# EAGLE design switches (EAGLE 9.6.2)
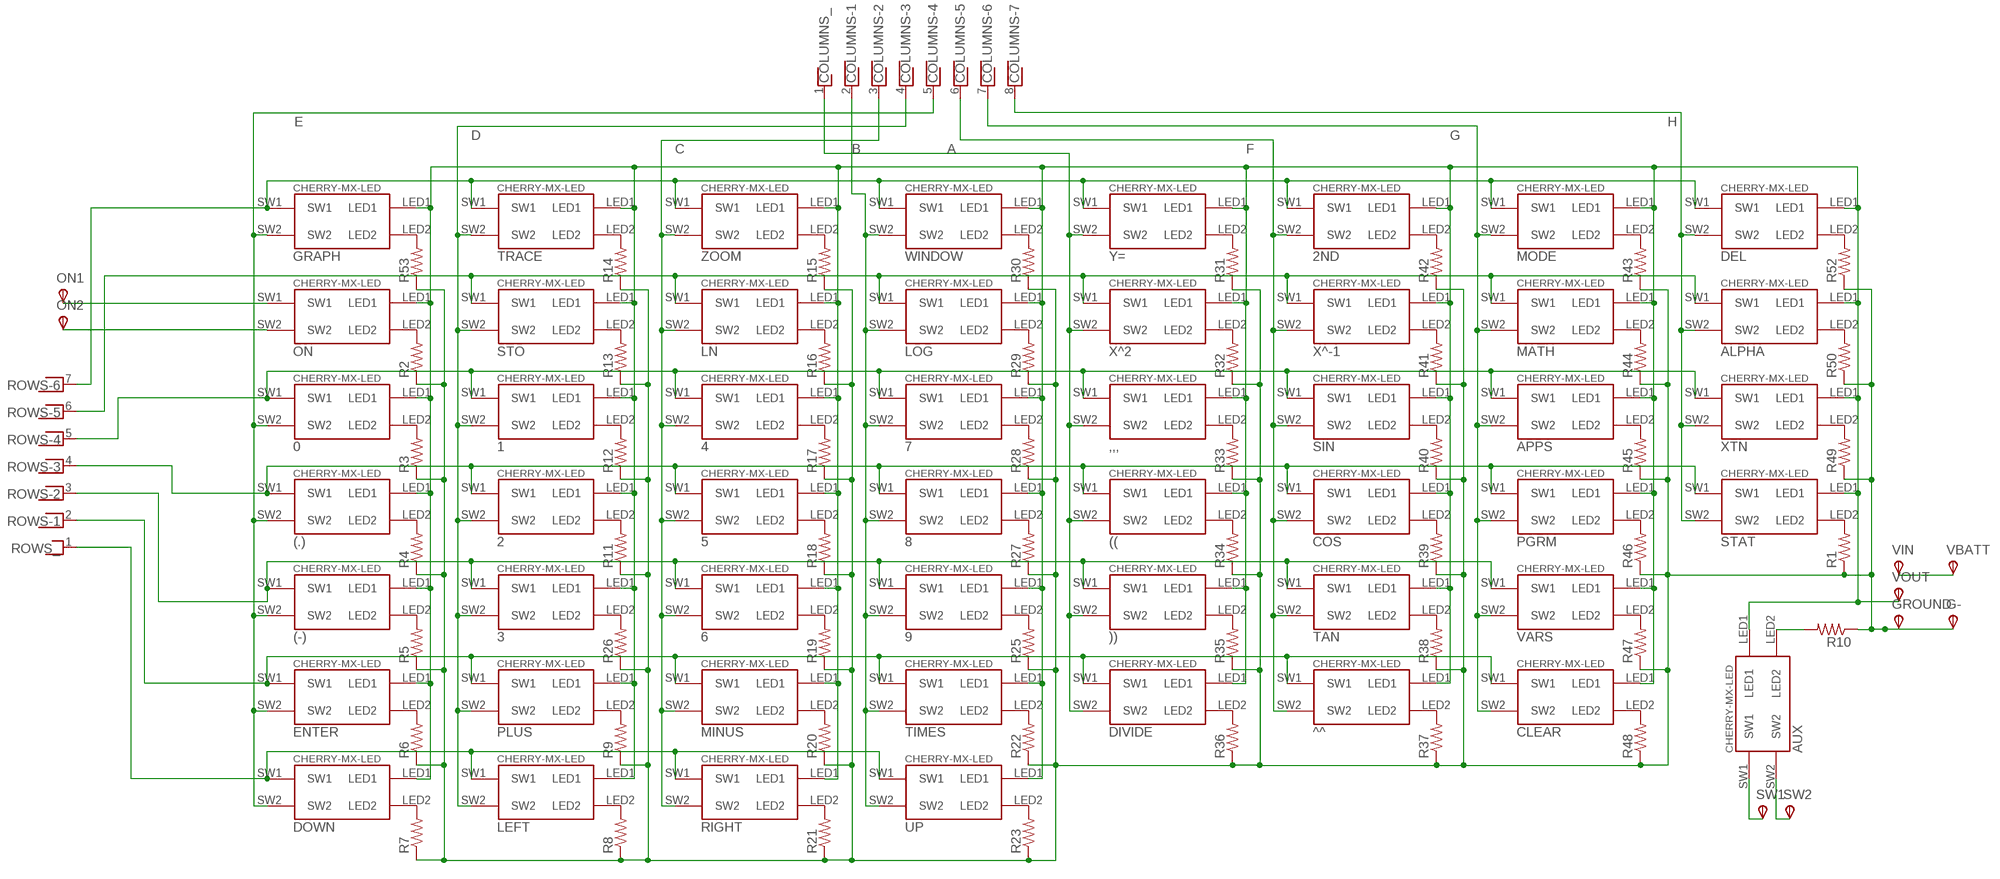
[diagram p0: schematic, sheet 1]

## Parts
0  CHERRY-MX-LEDNOSILK  [CHERRY-MX-LED-NOSILK]
1  CHERRY-MX-LEDNOSILK  [CHERRY-MX-LED-NOSILK]
2  CHERRY-MX-LEDNOSILK  [CHERRY-MX-LED-NOSILK]
2ND  CHERRY-MX-LEDNOSILK  [CHERRY-MX-LED-NOSILK]
3  CHERRY-MX-LEDNOSILK  [CHERRY-MX-LED-NOSILK]
4  CHERRY-MX-LEDNOSILK  [CHERRY-MX-LED-NOSILK]
5  CHERRY-MX-LEDNOSILK  [CHERRY-MX-LED-NOSILK]
6  CHERRY-MX-LEDNOSILK  [CHERRY-MX-LED-NOSILK]
7  CHERRY-MX-LEDNOSILK  [CHERRY-MX-LED-NOSILK]
8  CHERRY-MX-LEDNOSILK  [CHERRY-MX-LED-NOSILK]
9  CHERRY-MX-LEDNOSILK  [CHERRY-MX-LED-NOSILK]
((  CHERRY-MX-LEDNOSILK  [CHERRY-MX-LED-NOSILK]
(-)  CHERRY-MX-LEDNOSILK  [CHERRY-MX-LED-NOSILK]
(.)  CHERRY-MX-LEDNOSILK  [CHERRY-MX-LED-NOSILK]
))  CHERRY-MX-LEDNOSILK  [CHERRY-MX-LED-NOSILK]
,,,  CHERRY-MX-LEDNOSILK  [CHERRY-MX-LED-NOSILK]
^^  CHERRY-MX-LEDNOSILK  [CHERRY-MX-LED-NOSILK]
ALPHA  CHERRY-MX-LEDNOSILK  [CHERRY-MX-LED-NOSILK]
APPS  CHERRY-MX-LEDNOSILK  [CHERRY-MX-LED-NOSILK]
AUX  CHERRY-MX-LEDNOSILK  [CHERRY-MX-LED-NOSILK]
CLEAR  CHERRY-MX-LEDNOSILK  [CHERRY-MX-LED-NOSILK]
COLUMNS  RNX7  [RN-8]
COS  CHERRY-MX-LEDNOSILK  [CHERRY-MX-LED-NOSILK]
DEL  CHERRY-MX-LEDNOSILK  [CHERRY-MX-LED-NOSILK]
DIVIDE  CHERRY-MX-LEDNOSILK  [CHERRY-MX-LED-NOSILK]
DOWN  CHERRY-MX-LEDNOSILK  [CHERRY-MX-LED-NOSILK]
ENTER  CHERRY-MX-LEDNOSILK  [CHERRY-MX-LED-NOSILK]
G-  TPSPAD1-17  [P1-17]
GRAPH  CHERRY-MX-LEDNOSILK  [CHERRY-MX-LED-NOSILK]
GROUND  TPSPAD1-17  [P1-17]
LEFT  CHERRY-MX-LEDNOSILK  [CHERRY-MX-LED-NOSILK]
LN  CHERRY-MX-LEDNOSILK  [CHERRY-MX-LED-NOSILK]
LOG  CHERRY-MX-LEDNOSILK  [CHERRY-MX-LED-NOSILK]
MATH  CHERRY-MX-LEDNOSILK  [CHERRY-MX-LED-NOSILK]
MINUS  CHERRY-MX-LEDNOSILK  [CHERRY-MX-LED-NOSILK]
MODE  CHERRY-MX-LEDNOSILK  [CHERRY-MX-LED-NOSILK]
ON  CHERRY-MX-LEDNOSILK  [CHERRY-MX-LED-NOSILK]
ON1  TPSPAD1-17  [P1-17]
ON2  TPSPAD1-17  [P1-17]
PGRM  CHERRY-MX-LEDNOSILK  [CHERRY-MX-LED-NOSILK]
PLUS  CHERRY-MX-LEDNOSILK  [CHERRY-MX-LED-NOSILK]
R1  R-US_R0805  [R0805]
R2  R-US_R0805  [R0805]
R3  R-US_R0805  [R0805]
R4  R-US_R0805  [R0805]
R5  R-US_R0805  [R0805]
R6  R-US_R0805  [R0805]
R7  R-US_R0805  [R0805]
R8  R-US_R0805  [R0805]
R9  R-US_R0805  [R0805]
R10  R-US_R0805  [R0805]
R11  R-US_R0805  [R0805]
R12  R-US_R0805  [R0805]
R13  R-US_R0805  [R0805]
R14  R-US_R0805  [R0805]
R15  R-US_R0805  [R0805]
R16  R-US_R0805  [R0805]
R17  R-US_R0805  [R0805]
R18  R-US_R0805  [R0805]
R19  R-US_R0805  [R0805]
R20  R-US_R0805  [R0805]
R21  R-US_R0805  [R0805]
R22  R-US_R0805  [R0805]
R23  R-US_R0805  [R0805]
R25  R-US_R0805  [R0805]
R26  R-US_R0805  [R0805]
R27  R-US_R0805  [R0805]
R28  R-US_R0805  [R0805]
R29  R-US_R0805  [R0805]
R30  R-US_R0805  [R0805]
R31  R-US_R0805  [R0805]
R32  R-US_R0805  [R0805]
R33  R-US_R0805  [R0805]
R34  R-US_R0805  [R0805]
R35  R-US_R0805  [R0805]
R36  R-US_R0805  [R0805]
R37  R-US_R0805  [R0805]
R38  R-US_R0805  [R0805]
R39  R-US_R0805  [R0805]
R40  R-US_R0805  [R0805]
R41  R-US_R0805  [R0805]
R42  R-US_R0805  [R0805]
R43  R-US_R0805  [R0805]
R44  R-US_R0805  [R0805]
R45  R-US_R0805  [R0805]
R46  R-US_R0805  [R0805]
R47  R-US_R0805  [R0805]
R48  R-US_R0805  [R0805]
R49  R-US_R0805  [R0805]
R50  R-US_R0805  [R0805]
R52  R-US_R0805  [R0805]
R53  R-US_R0805  [R0805]
RIGHT  CHERRY-MX-LEDNOSILK  [CHERRY-MX-LED-NOSILK]
ROWS  RNX6  [RN-7]
SIN  CHERRY-MX-LEDNOSILK  [CHERRY-MX-LED-NOSILK]
STAT  CHERRY-MX-LEDNOSILK  [CHERRY-MX-LED-NOSILK]
STO  CHERRY-MX-LEDNOSILK  [CHERRY-MX-LED-NOSILK]
SW1  TPSPAD1-17  [P1-17]
SW2  TPSPAD1-17  [P1-17]
TAN  CHERRY-MX-LEDNOSILK  [CHERRY-MX-LED-NOSILK]
TIMES  CHERRY-MX-LEDNOSILK  [CHERRY-MX-LED-NOSILK]
TRACE  CHERRY-MX-LEDNOSILK  [CHERRY-MX-LED-NOSILK]
UP  CHERRY-MX-LEDNOSILK  [CHERRY-MX-LED-NOSILK]
VARS  CHERRY-MX-LEDNOSILK  [CHERRY-MX-LED-NOSILK]
VBATT  TPSPAD1-17  [P1-17]
VIN  TPSPAD1-17  [P1-17]
VOUT  TPSPAD1-17  [P1-17]
WINDOW  CHERRY-MX-LEDNOSILK  [CHERRY-MX-LED-NOSILK]
X^2  CHERRY-MX-LEDNOSILK  [CHERRY-MX-LED-NOSILK]
X^-1  CHERRY-MX-LEDNOSILK  [CHERRY-MX-LED-NOSILK]
XTN  CHERRY-MX-LEDNOSILK  [CHERRY-MX-LED-NOSILK]
Y=  CHERRY-MX-LEDNOSILK  [CHERRY-MX-LED-NOSILK]
ZOOM  CHERRY-MX-LEDNOSILK  [CHERRY-MX-LED-NOSILK]

## Nets
A: ((.SW2 )).SW2 ,,,.SW2 COLUMNS.1 DIVIDE.SW2 X^2.SW2 Y=.SW2
B: 7.SW2 8.SW2 9.SW2 COLUMNS.2 LOG.SW2 TIMES.SW2 UP.SW2 WINDOW.SW2
C: 4.SW2 5.SW2 6.SW2 COLUMNS.3 LN.SW2 MINUS.SW2 RIGHT.SW2 ZOOM.SW2
D: 1.SW2 2.SW2 3.SW2 COLUMNS.4 LEFT.SW2 PLUS.SW2 STO.SW2 TRACE.SW2
E: 0.SW2 (-).SW2 (.).SW2 COLUMNS.5 DOWN.SW2 ENTER.SW2 GRAPH.SW2
F: 2ND.SW2 ^^.SW2 COLUMNS.6 COS.SW2 SIN.SW2 TAN.SW2 X^-1.SW2
G: APPS.SW2 CLEAR.SW2 COLUMNS.7 MATH.SW2 MODE.SW2 PGRM.SW2 VARS.SW2
H: ALPHA.SW2 COLUMNS.8 DEL.SW2 STAT.SW2 XTN.SW2
N$1: 2ND.SW1 DEL.SW1 GRAPH.SW1 MODE.SW1 ROWS.7 TRACE.SW1 WINDOW.SW1 Y=.SW1 ZOOM.SW1
N$2: ALPHA.SW1 LN.SW1 LOG.SW1 MATH.SW1 ROWS.6 STO.SW1 X^2.SW1 X^-1.SW1
N$3: 0.SW1 1.SW1 4.SW1 7.SW1 ,,,.SW1 APPS.SW1 ROWS.5 SIN.SW1 XTN.SW1
N$4: 2.SW1 5.SW1 8.SW1 ((.SW1 (.).SW1 COS.SW1 PGRM.SW1 ROWS.4 STAT.SW1
N$5: 3.SW1 6.SW1 9.SW1 (-).SW1 )).SW1 ROWS.3 TAN.SW1 VARS.SW1
N$6: ^^.SW1 CLEAR.SW1 DIVIDE.SW1 ENTER.SW1 MINUS.SW1 PLUS.SW1 ROWS.2 TIMES.SW1
N$7: DOWN.SW1 LEFT.SW1 RIGHT.SW1 ROWS.1 UP.SW1
N$16: ON.LED2 R2.2
N$17: 0.LED2 R3.2
N$18: (.).LED2 R4.2
N$19: (-).LED2 R5.2
N$20: ENTER.LED2 R6.2
N$21: DOWN.LED2 R7.2
N$22: LEFT.LED2 R8.2
N$23: PLUS.LED2 R9.2
N$24: 2.LED2 R11.2
N$25: 1.LED2 R12.2
N$26: R13.2 STO.LED2
N$27: R14.2 TRACE.LED2
N$28: R15.2 ZOOM.LED2
N$29: LN.LED2 R16.2
N$30: 4.LED2 R17.2
N$31: 5.LED2 R18.2
N$32: 6.LED2 R19.2
N$33: MINUS.LED2 R20.2
N$34: R21.2 RIGHT.LED2
N$35: R22.2 TIMES.LED2
N$36: R23.2 UP.LED2
N$37: 9.LED2 R25.2
N$38: 3.LED2 R26.2
N$39: 8.LED2 R27.2
N$40: 7.LED2 R28.2
N$41: LOG.LED2 R29.2
N$42: R30.2 WINDOW.LED2
N$43: R31.2 Y=.LED2
N$44: R32.2 X^2.LED2
N$45: ,,,.LED2 R33.2
N$46: ((.LED2 R34.2
N$47: )).LED2 R35.2
N$48: DIVIDE.LED2 R36.2
N$49: ^^.LED2 R37.2
N$50: R38.2 TAN.LED2
N$51: COS.LED2 R39.2
N$52: R40.2 SIN.LED2
N$53: R41.2 X^-1.LED2
N$54: 2ND.LED2 R42.2
N$55: MODE.LED2 R43.2
N$56: MATH.LED2 R44.2
N$57: APPS.LED2 R45.2
N$58: PGRM.LED2 R46.2
N$59: R47.2 VARS.LED2
N$60: CLEAR.LED2 R48.2
N$61: GRAPH.LED2 R53.2
N$62: R1.2 STAT.LED2
N$63: R49.2 XTN.LED2
N$64: ALPHA.LED2 R50.2
N$65: DEL.LED2 R52.2
N$66 [LED]: G-.TP(PP) GROUND.TP(PP) R1.1 R2.1 R3.1 R4.1 R5.1 R6.1 R7.1 R8.1 R9.1 R10.1 R11.1 R12.1 R13.1 R14.1 R15.1 R16.1 R17.1 R18.1 R19.1 R20.1 R21.1 R22.1 R23.1 R25.1 R26.1 R27.1 R28.1 R29.1 R30.1 R31.1 R32.1 R33.1 R34.1 R35.1 R36.1 R37.1 R38.1 R39.1 R40.1 R41.1 R42.1 R43.1 R44.1 R45.1 R46.1 R47.1 R48.1 R49.1 R50.1 R52.1 R53.1
N$67: AUX.LED2 R10.2
N$68: AUX.SW1 SW1.TP(PP)
N$69: AUX.SW2 SW2.TP(PP)
N$70 [LED]: VBATT.TP(PP) VIN.TP(PP)
N$71: ON1.TP(PP) ON.SW1
N$72: ON2.TP(PP) ON.SW2
N$76 [LED]: 0.LED1 1.LED1 2.LED1 2ND.LED1 3.LED1 4.LED1 5.LED1 6.LED1 7.LED1 8.LED1 9.LED1 ((.LED1 (-).LED1 (.).LED1 )).LED1 ,,,.LED1 ^^.LED1 ALPHA.LED1 APPS.LED1 AUX.LED1 CLEAR.LED1 COS.LED1 DEL.LED1 DIVIDE.LED1 DOWN.LED1 ENTER.LED1 GRAPH.LED1 LEFT.LED1 LN.LED1 LOG.LED1 MATH.LED1 MINUS.LED1 MODE.LED1 ON.LED1 PGRM.LED1 PLUS.LED1 RIGHT.LED1 SIN.LED1 STAT.LED1 STO.LED1 TAN.LED1 TIMES.LED1 TRACE.LED1 UP.LED1 VARS.LED1 VOUT.TP(PP) WINDOW.LED1 X^2.LED1 X^-1.LED1 XTN.LED1 Y=.LED1 ZOOM.LED1

## Library data of the parts
0 1 2 2ND 3-9 (( (-) (.) )) ,,, ^^ ALPHA APPS AUX CLEAR COS DEL DIVIDE DOWN ENTER GRAPH LEFT LN LOG MATH MINUS MODE ON PGRM PLUS RIGHT SIN STAT STO TAN TIMES TRACE UP VARS WINDOW X^2 X^-1 XTN Y= ZOOM = cherrymx:CHERRY-MX-LED: Cherry MX series keyswitch with LED
COLUMNS = resistor-net:RNX7: RESISTOR NETWORK; OC_FARNELL: unknown; OC_NEWARK: unknown
G- GROUND ON1 ON2 SW1 SW2 VBATT VIN VOUT = testpad:TPS: TEST PIN
R1-R23 R25-R50 R52 R53 = rcl:R-US_: RESISTOR, American symbol; SPICEPREFIX: R
ROWS = resistor-net:RNX6: RESISTOR NETWORK; OC_FARNELL: unknown; OC_NEWARK: unknown

## Net classes
0 default: width 0.178 mm
1 LED: width 0.381 mm

## Board
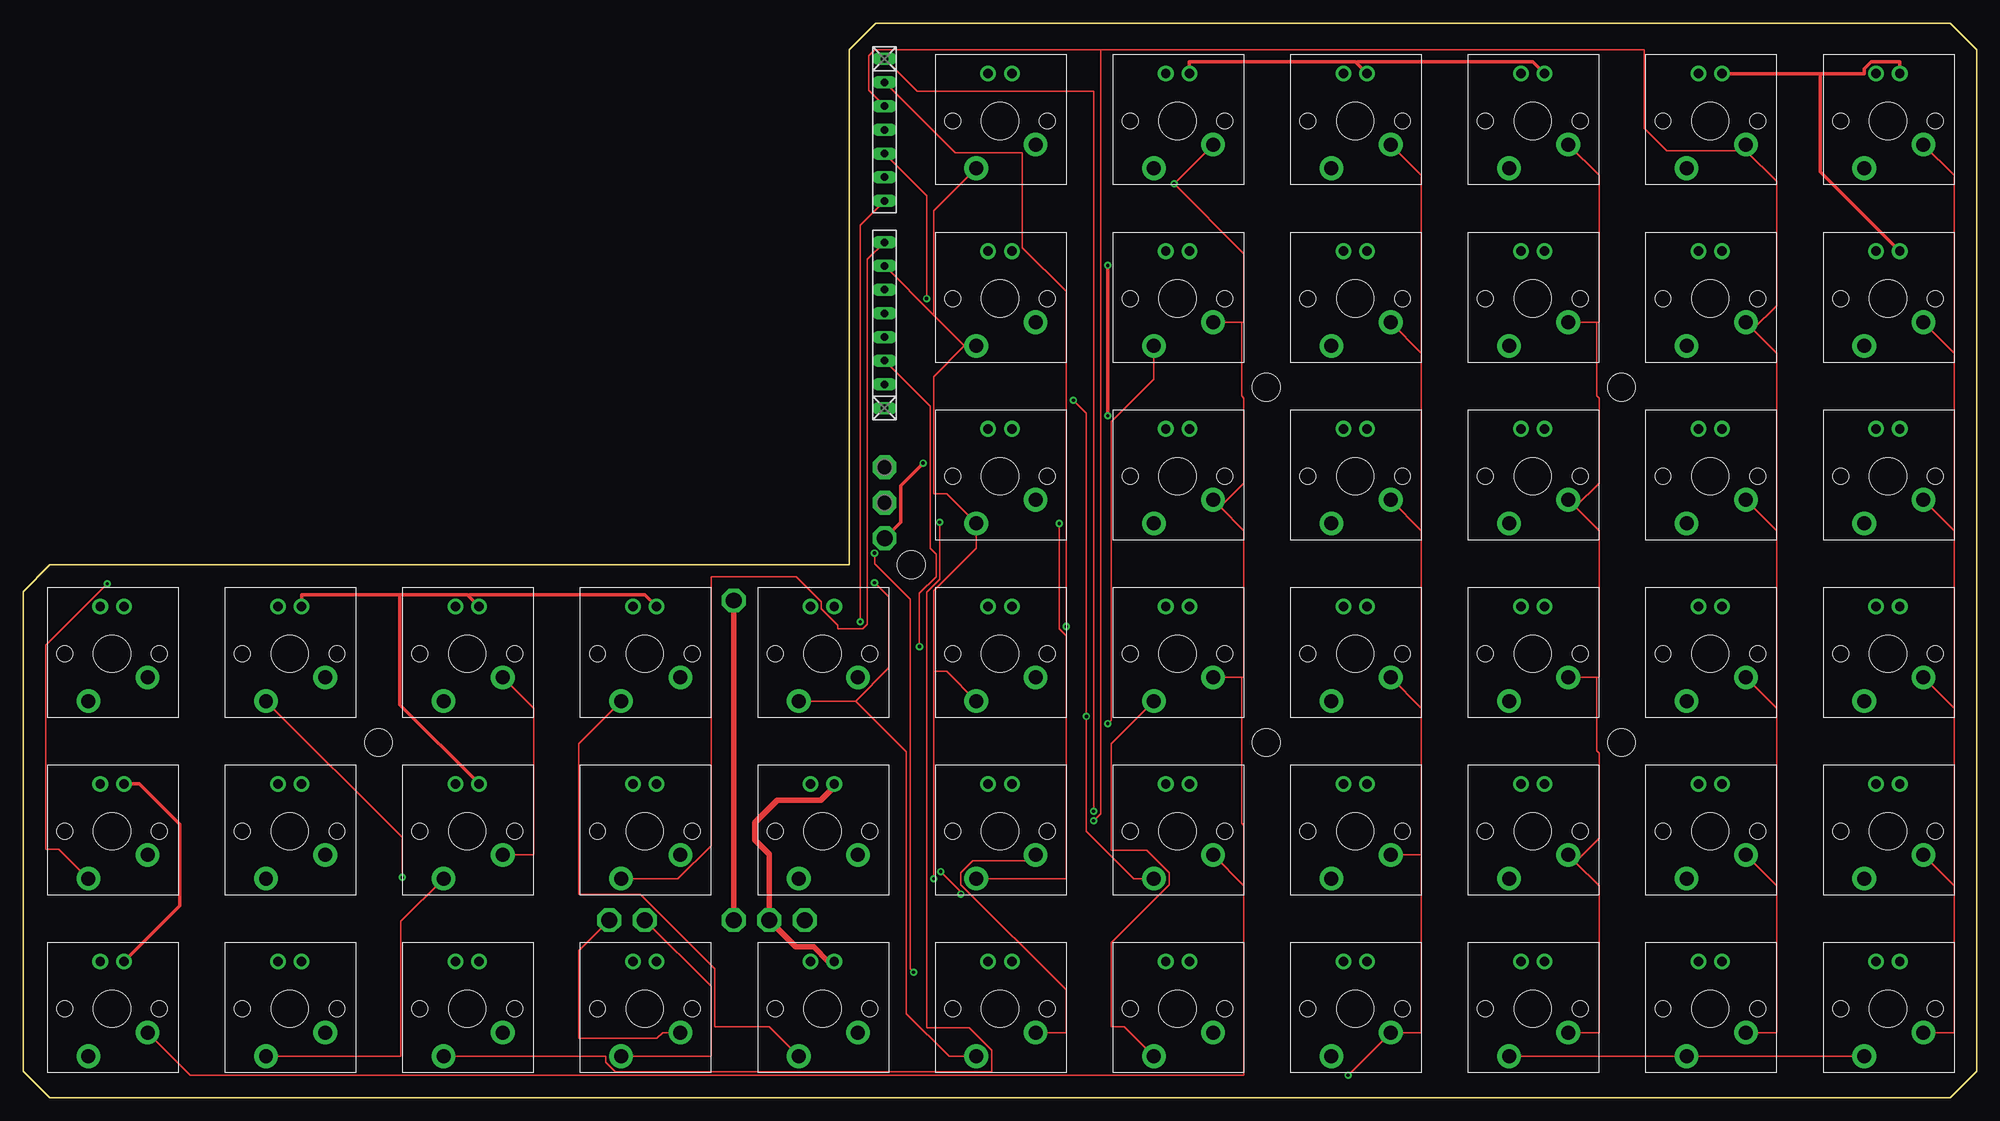
[diagram p1: board, top side]
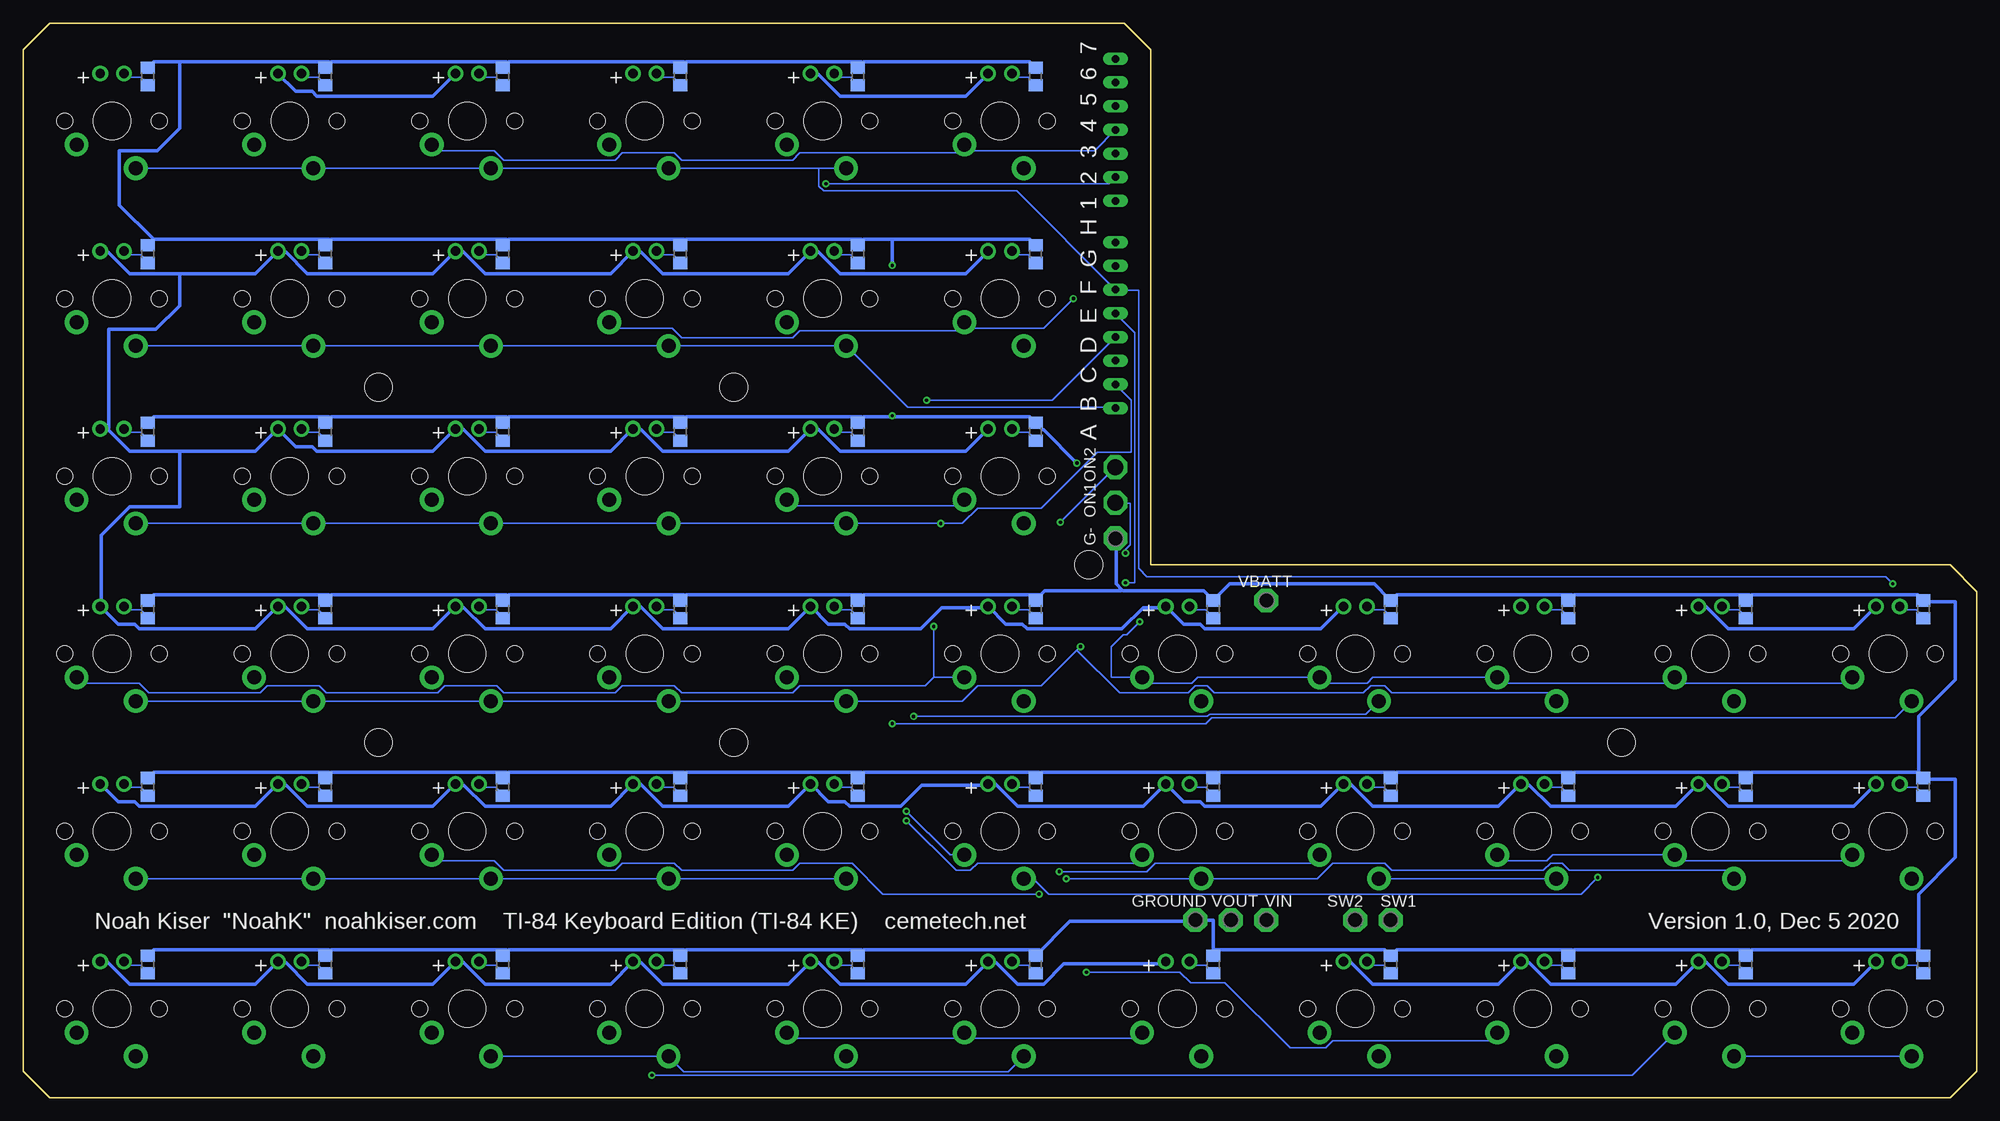
[diagram p2: board, bottom side, seen from below]

Size 209.55 x 115.25 mm. Coordinates in mm from the lower left corner, seen from the top.
Outline: 0,2.86 0,54.29 2.86,57.15 88.58,57.15 88.58,112.39 91.44,115.25 206.69,115.25 209.55,112.39 209.55,2.86 206.69,0 2.86,0 0,2.86
Copper layers (1*16): Top 0.035mm / dielectric 1.5mm / Bottom 0.035mm
Design rules "default *": minimum track width 7mil, minimum drill 0.35mm, track to track 8mil, track to pad 8mil, pad to pad 8mil, via to via 8mil, smd to smd 6mil, copper to edge 40mil, drill to drill 6mil, minimum pad ring 10mil, minimum via ring 8mil, stop-mask expansion 4mil, vias tented up to drill 0mil, thermal gap 10mil
Holes 3 mm at 171.45,76.2 171.45,38.1 133.35,38.1 133.35,76.2 95.25,57.15 38.1,38.1

### Footprints (pad centres in the part's own frame; a part is rotated, then mirrored left to right if it is on the bottom)
CHERRY-MX-LED-NOSILK = drill 1.016 pad 1.676: LED1 -1.27,-5.08; LED2 1.27,-5.08 | drill 1.5 pad 2.54: SW1 -3.81,2.54; SW2 2.54,5.08 | hole 4: 0,0 | hole 1.714: 5.08,0; -5.08,0
RN-8 = drill 0.813 long: 1 -8.89,0; 2 -6.35,0; 3 -3.81,0; 4 -1.27,0; 5 1.27,0; 6 3.81,0; 7 6.35,0; 8 8.89,0
P1-17 = drill 1.702 pad 2.54 octagon: TP 0,0
R0805 = smd 1.3 x 1.5: 1 -0.95,0; 2 0.95,0
RN-7 = drill 0.813 long: 1 -7.62,0; 2 -5.08,0; 3 -2.54,0; 4 0,0; 5 2.54,0; 6 5.08,0; 7 7.62,0

### Placement (x,y rotation side)
0  142.88,9.53 180 top
1  142.88,28.58 180 top
2  161.92,28.58 180 top
2ND  9.53,28.58 180 top
3  180.97,28.58 180 top
4  142.88,47.62 180 top
5  161.92,47.62 180 top
6  180.97,47.62 180 top
7  142.88,66.67 180 top
8  161.92,66.67 180 top
9  180.97,66.67 180 top
((  161.92,85.72 180 top
(-)  180.97,9.53 180 top
(.)  161.92,9.53 180 top
))  180.97,85.72 180 top
,,,  142.88,85.72 180 top
^^  200.03,104.77 180 top
ALPHA  9.53,9.53 180 top
APPS  104.77,85.72 180 top
AUX  66.67,9.53 180 top
CLEAR  104.77,47.62 180 top
COLUMNS  92.39,82.87 90 top
COS  161.92,104.77 180 top
DEL  47.62,28.58 180 top
DIVIDE  200.03,85.72 180 top
DOWN  104.77,9.53 180 top
ENTER  200.03,9.53 180 top
G-  92.39,60.01 0 bottom
GRAPH  85.72,47.62 180 top
GROUND  83.82,19.05 0 bottom
LEFT  85.72,9.53 180 top
LN  123.82,47.62 180 top
LOG  123.82,66.67 180 top
MATH  104.77,66.67 180 top
MINUS  200.03,47.62 180 top
MODE  28.58,28.58 180 top
ON  47.62,9.53 180 top
ON1  92.39,63.82 0 top
ON2  92.39,67.63 0 top
PGRM  104.77,104.77 180 top
PLUS  200.03,28.58 180 top
R1  62.87,33.34 270 bottom
R2  43.82,14.29 270 bottom
R3  139.06,14.29 270 bottom
R4  158.11,14.29 270 bottom
R5  177.16,14.29 270 bottom
R6  196.22,14.29 270 bottom
R7  100.96,14.29 270 bottom
R8  81.91,14.29 270 bottom
R9  196.22,33.34 270 bottom
R10  62.87,14.29 270 bottom
R11  158.11,33.34 270 bottom
R12  139.06,33.34 270 bottom
R13  120.01,33.34 270 bottom
R14  62.87,52.39 270 bottom
R15  43.82,52.39 270 bottom
R16  120.01,52.39 270 bottom
R17  139.06,52.39 270 bottom
R18  158.11,52.39 270 bottom
R19  177.16,52.39 270 bottom
R20  196.22,52.39 270 bottom
R21  120.01,14.29 270 bottom
R22  196.22,71.44 270 bottom
R23  100.96,33.34 270 bottom
R25  177.16,71.44 270 bottom
R26  177.16,33.34 270 bottom
R27  158.11,71.44 270 bottom
R28  139.06,71.44 270 bottom
R29  120.01,71.44 270 bottom
R30  24.77,52.39 270 bottom
R31  5.71,52.39 270 bottom
R32  120.01,90.49 270 bottom
R33  139.06,90.49 270 bottom
R34  158.11,90.49 270 bottom
R35  177.16,90.49 270 bottom
R36  196.22,90.49 270 bottom
R37  196.22,109.54 270 bottom
R38  177.16,109.54 270 bottom
R39  158.11,109.54 270 bottom
R40  139.06,109.54 270 bottom
R41  120.01,109.54 270 bottom
R42  5.71,33.34 270 bottom
R43  24.77,33.34 270 bottom
R44  100.96,71.44 270 bottom
R45  100.96,90.49 270 bottom
R46  100.96,109.54 270 bottom
R47  81.91,33.34 270 bottom
R48  100.96,52.39 270 bottom
R49  24.77,14.29 270 bottom
R50  5.71,14.29 270 bottom
R52  43.82,33.34 270 bottom
R53  81.91,52.39 270 bottom
RIGHT  123.82,9.53 180 top
ROWS  92.39,103.82 270 top
SIN  142.88,104.77 180 top
STAT  66.67,28.58 180 top
STO  123.82,28.58 180 top
SW1  62.87,19.05 0 bottom
SW2  66.67,19.05 0 bottom
TAN  180.97,104.77 180 top
TIMES  200.03,66.67 180 top
TRACE  66.67,47.62 180 top
UP  104.77,28.58 180 top
VARS  85.72,28.58 180 top
VBATT  76.2,53.34 0 bottom
VIN  76.2,19.05 0 bottom
VOUT  80.01,19.05 0 bottom
WINDOW  28.58,47.62 180 top
X^2  123.82,85.72 180 top
X^-1  123.82,104.77 180 top
XTN  28.58,9.53 180 top
Y=  9.53,47.62 180 top
ZOOM  47.62,47.62 180 top

### Tracks (layer width: path | path; a pad name or v marks a point on that pad's centre or on a via)
A  (via drill 0.35)
  Top 0.178: v116.33,40.13 116.71,40.51 116.71,72.52 121.28,77.09 X^2.SW2
  Bottom 0.178: COLUMNS.1 92.46,74.04 114.68,74.04 X^2.SW2 ,,,.SW2 ((.SW2 )).SW2 DIVIDE.SW2 | Y=.SW2 8.76,40.77 82.04,40.77 82.68,40.13 v116.33,40.13
B  (via drill 0.35)
  Top 0.178: UP.SW2 111.89,23.5 111.89,49.53 111.12,50.29 v111.12,61.6 | WINDOW.SW2 40.64,27.94 v40.64,23.62
  Bottom 0.178: COLUMNS.2 90.68,74.8 90.68,69.21 94.36,69.21 100.33,63.25 107.19,63.25 108.84,61.6 v111.12,61.6 LOG.SW2 7.SW2 8.SW2 9.SW2 TIMES.SW2 | v40.64,23.62 42.42,21.84 99.57,21.84 101.22,23.5 UP.SW2
C  (via drill 0.35)
  Top 0.178: COLUMNS.3 97.28,74.17 97.28,58.93 97.92,58.29 97.92,55.88 96.14,54.1 v96.14,48.39 | RIGHT.SW2 118.11,7.62 116.71,7.62 116.71,16.64 122.94,22.86 122.94,24.13 120.52,26.54 116.71,26.54 116.71,37.97 LN.SW2
  Bottom 0.178: 96.52,48.01 100.33,44.2 107.19,44.2 108.84,42.55 LN.SW2 4.SW2 5.SW2 6.SW2 MINUS.SW2 | 96.52,48.01 v96.14,48.39 | ZOOM.SW2 45.97,43.43 62.74,43.43 63.5,44.2 65.02,44.2 65.79,43.43 81.79,43.43 82.55,44.2 83.82,44.2 84.58,43.43 91.95,43.43 96.52,48.01
D  (via drill 0.35)
  Top 0.178: LEFT.SW2 80.01,7.62 74.17,7.62 74.17,13.84 66.17,21.84 59.56,21.84 59.56,37.97 TRACE.SW2 | v112.65,74.8 114.05,73.41 v114.05,40.89 114.05,28.58 119.13,23.5 STO.SW2
  Bottom 0.178: COLUMNS.4 99.19,74.8 v112.65,74.8 | STO.SW2 1.SW2 2.SW2 3.SW2 PLUS.SW2 | TRACE.SW2 65.53,41.15 82.3,41.15 82.55,40.89 v114.05,40.89
E  (via drill 0.35)
  Top 0.178: v91.31,55.24 92.84,53.72 92.84,46.1 89.28,42.55 | GRAPH.SW2 89.28,42.55 | (.).SW2 (-).SW2 ENTER.SW2 | 89.28,42.55 94.74,37.08 94.74,9.02 99.31,4.45 DOWN.SW2
  Bottom 0.178: COLUMNS.5 90.3,82.04 90.3,55.24 v91.31,55.24 | DOWN.SW2 103.89,2.79 138.68,2.79 0.SW2 (.).SW2
F  (via drill 0.35)
  Top 0.178: 2ND.SW2 3.81,26.67 2.41,26.67 2.41,48.51 v9.02,55.12
  Bottom 0.178: 124.21,99.69 124.21,97.79 123.7,97.28 103,97.28 COLUMNS.6 92.33,86.61 89.92,86.61 89.92,56.77 89.03,55.88 9.78,55.88 v9.02,55.12 | X^-1.SW2 124.21,99.69 | 124.21,99.69 SIN.SW2 COS.SW2 TAN.SW2 ^^.SW2
G  (via drill 0.35)
  Top 0.178: CLEAR.SW2 99.06,45.72 97.66,45.72 | 97.66,45.72 97.66,54.36 102.23,58.93 MATH.SW2 99.06,64.77 97.66,64.77 97.66,77.34 100.96,80.64 | 100.96,80.64 97.66,83.95 | 97.66,83.95 COLUMNS.7 | APPS.SW2 100.96,80.64 | PGRM.SW2 97.66,95.12 97.66,83.95 | 97.66,45.72 v97.66,23.5
  Bottom 0.178: MODE.SW2 26.92,24.38 43.69,24.38 44.45,25.15 45.72,25.15 46.48,24.38 62.74,24.38 63.5,25.15 69.09,25.15 70.74,23.5 VARS.SW2 v97.66,23.5
H
  Top 0.178: COLUMNS.8 90.55,89.92 90.55,50.8 90.04,50.29 87.38,50.29 87.38,50.67 85.6,52.45 85.6,53.21 82.93,55.88 73.79,55.88 73.79,27.05 70.23,23.5 STAT.SW2 | XTN.SW2 40.51,4.45 40.51,18.92 DEL.SW2
  Bottom 0.178: XTN.SW2 ALPHA.SW2 | STAT.SW2 DEL.SW2
N$1  (via drill 0.35)
  Top 0.178: ROWS.7 89.79,93.6 v89.79,51.05 | DEL.SW1 54.74,26.04 54.74,41.78 ZOOM.SW1
  Bottom 0.178: v89.79,51.05 91.19,49.66 91.57,49.66 92.84,48.39 92.84,45.09 GRAPH.SW1 88.9,44.45 84.2,44.45 83.57,45.09 TRACE.SW1 69.85,44.45 65.41,44.45 64.77,45.09 ZOOM.SW1 50.8,44.45 31.75,44.45 | 2ND.SW1 13.97,25.4 31.75,25.4 MODE.SW1 45.47,26.04 46.1,25.4 50.8,25.4 DEL.SW1 | Y=.SW1 13.97,44.45 31.75,44.45 | 31.75,44.45 WINDOW.SW1
N$2  (via drill 0.35)
  Top 0.178: 130.68,45.09 130.94,45.09 130.94,60.83 128.4,63.37 | 130.68,45.09 LN.SW1 | X^-1.SW1 v123.44,98.04 130.94,90.55 130.94,83.18 130.68,83.18 | 130.68,83.18 X^2.SW1 | 128.4,63.37 130.94,65.91 130.94,75.06 130.68,75.31 130.68,83.18 | 128.4,63.37 LOG.SW1 | ALPHA.SW1 17.91,2.41 130.94,2.41 130.94,22.73 | STO.SW1 130.94,22.73 | 130.68,45.09 130.68,29.46 130.94,29.21 130.94,22.73
  Bottom 0.178: MATH.SW1 109.22,63.5 127,63.5 LOG.SW1 | ROWS.6 93.09,98.04 v123.44,98.04
N$3  (via drill 0.35)
  Top 0.178: v142.11,2.41 0.SW1 149.99,6.99 149.99,26.04 | ROWS.5 96.9,96.77 v96.9,85.72 | 149.99,26.04 1.SW1 | 149.99,41.78 149.99,26.04 | 4.SW1 149.99,41.78 | 149.99,60.83 7.SW1 | 149.99,41.78 149.99,60.83 | 149.99,79.88 ,,,.SW1 | 149.99,60.83 149.99,79.88 | SIN.SW1 149.99,98.93 149.99,79.88
  Bottom 0.178: XTN.SW1 36.96,2.41 v142.11,2.41 | v96.9,85.72 100.08,82.55 107.95,82.55 APPS.SW1 109.47,82.3 126.24,82.3 127,81.53 138.94,81.53 139.95,82.55 146.05,82.55 ,,,.SW1
N$4  (via drill 0.35)
  Top 0.178: v98.42,24.26 100.58,22.1 v100.58,21.84 | (.).SW1 169.04,6.99 169.04,22.73 166.5,25.27 | 168.78,45.09 169.04,45.09 169.04,60.83 166.5,63.37 | 168.78,45.09 5.SW1 | 168.78,83.18 169.04,83.18 169.04,98.93 COS.SW1 | 168.78,83.18 ((.SW1 | 166.5,63.37 169.04,65.91 169.04,75.06 168.78,75.31 168.78,83.18 | 166.5,63.37 8.SW1 | 166.5,25.27 169.04,27.81 169.04,36.96 168.78,37.21 168.78,45.09 | 166.5,25.27 2.SW1
  Bottom 0.178: STAT.SW1 71.37,25.15 88.14,25.15 89.03,24.26 v98.42,24.26 | v100.58,21.84 117.35,21.84 120.65,25.15 126.24,25.15 127,24.38 138.94,24.38 139.7,25.15 145.29,25.15 146.05,24.38 157.99,24.38 159,25.4 165.1,25.4 2.SW1 | ROWS.4 94.61,101.6 107.95,101.6 PGRM.SW1 109.47,101.35 126.24,101.35 127,100.58 138.94,100.58 139.7,101.35 145.29,101.35 146.05,100.58 157.99,100.58 159,101.6 165.1,101.6 COS.SW1
N$5  (via drill 0.35)
  Top 0.178: (-).SW1 188.09,6.99 188.09,22.73 | 3.SW1 188.09,22.73 | 188.09,41.78 6.SW1 | 188.09,22.73 188.09,41.78 | 188.09,60.83 9.SW1 | 188.09,41.78 188.09,60.83 | 185.55,82.42 188.09,79.88 188.09,60.83 | ROWS.3 90.68,108.08 90.68,111.76 91.31,112.39 115.57,112.39 | 115.57,112.39 173.86,112.39 173.86,104.01 176.28,101.6 184.78,101.6 | v114.81,29.72 115.57,30.48 115.57,112.39 | 185.55,82.42 188.09,84.96 188.09,98.3 184.78,101.6 | 185.55,82.42 )).SW1 | 184.78,101.6 TAN.SW1
  Bottom 0.178: VARS.SW1 90.42,25.15 107.19,25.15 107.95,24.38 109.47,24.38 v114.81,29.72
N$6  (via drill 0.35)
  Top 0.178: ROWS.2 99.95,101.35 107.19,101.35 107.19,91.19 111.89,86.49 v111.89,50.55 | ENTER.SW1 207.14,6.99 207.14,22.73 | PLUS.SW1 207.14,22.73 | 207.14,41.78 MINUS.SW1 | 207.14,22.73 207.14,41.78 | 207.14,60.83 TIMES.SW1 | 207.14,41.78 207.14,60.83 | 207.14,79.88 DIVIDE.SW1 | 207.14,60.83 207.14,79.88 | ^^.SW1 207.14,98.93 207.14,79.88
  Bottom 0.178: 111.89,45.09 v111.89,50.55 | CLEAR.SW1 111.89,45.09 | 111.89,45.09 112.78,44.2 126.24,44.2 127,43.43 138.94,43.43 139.7,44.2 145.29,44.2 146.05,43.43 157.99,43.43 158.75,44.2 164.34,44.2 165.1,43.43 177.04,43.43 177.8,44.2 183.39,44.2 184.15,43.43 196.09,43.43 197.1,44.45 203.2,44.45 MINUS.SW1
N$7  (via drill 0.35)
  Top 0.178: ROWS.1 95.88,107.95 114.81,107.95 v114.81,30.73 | DOWN.SW1 111.89,6.99 111.89,11.56 100.58,22.86 100.58,24.13 101.85,25.4 108.58,25.4 UP.SW1
  Bottom 0.178: LEFT.SW1 90.17,6.35 107.95,6.35 | RIGHT.SW1 127,6.35 107.95,6.35 | 107.95,6.35 DOWN.SW1 | v114.81,30.73 110.11,26.04 UP.SW1
N$16
  Bottom 0.178: ON.LED2 45.97,14.22 44.58,14.22 43.82,13.46 R2.2
N$17
  Bottom 0.178: 0.LED2 141.22,14.22 139.83,14.22 139.06,13.46 R3.2
N$18
  Bottom 0.178: (.).LED2 160.27,14.22 158.88,14.22 158.11,13.46 R4.2
N$19
  Bottom 0.178: (-).LED2 179.32,14.22 177.93,14.22 177.16,13.46 R5.2
N$20
  Bottom 0.178: ENTER.LED2 198.37,14.22 196.98,14.22 196.22,13.46 R6.2
N$21
  Bottom 0.178: DOWN.LED2 103.12,14.22 101.73,14.22 100.96,13.46 R7.2
N$22
  Bottom 0.178: LEFT.LED2 84.07,14.22 82.68,14.22 81.91,13.46 R8.2
N$23
  Bottom 0.178: PLUS.LED2 198.37,33.27 196.98,33.27 196.22,32.51 R9.2
N$24
  Bottom 0.178: 2.LED2 160.27,33.27 158.88,33.27 158.11,32.51 R11.2
N$25
  Bottom 0.178: 1.LED2 141.22,33.27 139.83,33.27 139.06,32.51 R12.2
N$26
  Bottom 0.178: STO.LED2 122.17,33.27 120.78,33.27 120.01,32.51 R13.2
N$27
  Bottom 0.178: TRACE.LED2 65.02,52.32 63.63,52.32 62.87,51.56 R14.2
N$28
  Bottom 0.178: ZOOM.LED2 45.97,52.32 44.58,52.32 43.82,51.56 R15.2
N$29
  Bottom 0.178: LN.LED2 122.17,52.32 120.78,52.32 120.01,51.56 R16.2
N$30
  Bottom 0.178: 4.LED2 141.22,52.32 139.83,52.32 139.06,51.56 R17.2
N$31
  Bottom 0.178: 5.LED2 160.27,52.32 158.88,52.32 158.11,51.56 R18.2
N$32
  Bottom 0.178: 6.LED2 179.32,52.32 177.93,52.32 177.16,51.56 R19.2
N$33
  Bottom 0.178: MINUS.LED2 198.37,52.32 196.98,52.32 196.22,51.56 R20.2
N$34
  Bottom 0.178: RIGHT.LED2 122.17,14.22 120.78,14.22 120.01,13.46 R21.2
N$35
  Bottom 0.178: TIMES.LED2 198.37,71.37 196.98,71.37 196.22,70.61 R22.2
N$36
  Bottom 0.178: UP.LED2 103.12,33.27 101.73,33.27 100.96,32.51 R23.2
N$37
  Bottom 0.178: 9.LED2 179.32,71.37 177.93,71.37 177.16,70.61 R25.2
N$38
  Bottom 0.178: 3.LED2 179.32,33.27 177.93,33.27 177.16,32.51 R26.2
N$39
  Bottom 0.178: 8.LED2 160.27,71.37 158.88,71.37 158.11,70.61 R27.2
N$40
  Bottom 0.178: 7.LED2 141.22,71.37 139.83,71.37 139.06,70.61 R28.2
N$41
  Bottom 0.178: LOG.LED2 122.17,71.37 120.78,71.37 120.01,70.61 R29.2
N$42
  Bottom 0.178: WINDOW.LED2 26.92,52.32 25.53,52.32 24.77,51.56 R30.2
N$43
  Bottom 0.178: Y=.LED2 7.87,52.32 6.48,52.32 5.71,51.56 R31.2
N$44
  Bottom 0.178: X^2.LED2 122.17,90.42 120.78,90.42 120.01,89.66 R32.2
N$45
  Bottom 0.178: ,,,.LED2 141.22,90.42 139.83,90.42 139.06,89.66 R33.2
N$46
  Bottom 0.178: ((.LED2 160.27,90.42 158.88,90.42 158.11,89.66 R34.2
N$47
  Bottom 0.178: )).LED2 179.32,90.42 177.93,90.42 177.16,89.66 R35.2
N$48
  Bottom 0.178: DIVIDE.LED2 198.37,90.42 196.98,90.42 196.22,89.66 R36.2
N$49
  Bottom 0.178: ^^.LED2 198.37,109.47 196.98,109.47 196.22,108.71 R37.2
N$50
  Bottom 0.178: TAN.LED2 179.32,109.47 177.93,109.47 177.16,108.71 R38.2
N$51
  Bottom 0.178: COS.LED2 160.27,109.47 158.88,109.47 158.11,108.71 R39.2
N$52
  Bottom 0.178: SIN.LED2 141.22,109.47 139.83,109.47 139.06,108.71 R40.2
N$53
  Bottom 0.178: X^-1.LED2 122.17,109.47 120.78,109.47 120.01,108.71 R41.2
N$54
  Bottom 0.178: 2ND.LED2 7.87,33.27 6.48,33.27 5.71,32.51 R42.2
N$55
  Bottom 0.178: MODE.LED2 26.92,33.27 25.53,33.27 24.77,32.51 R43.2
N$56
  Bottom 0.178: MATH.LED2 103.12,71.37 101.73,71.37 100.96,70.61 R44.2
N$57
  Bottom 0.178: APPS.LED2 103.12,90.42 101.73,90.42 100.96,89.66 R45.2
N$58
  Bottom 0.178: PGRM.LED2 103.12,109.47 101.73,109.47 100.96,108.71 R46.2
N$59
  Bottom 0.178: VARS.LED2 84.07,33.27 82.68,33.27 81.91,32.51 R47.2
N$60
  Bottom 0.178: CLEAR.LED2 103.12,52.32 101.73,52.32 100.96,51.56 R48.2
N$61
  Bottom 0.178: GRAPH.LED2 84.07,52.32 82.68,52.32 81.91,51.56 R53.2
N$62
  Bottom 0.178: STAT.LED2 65.02,33.27 63.63,33.27 62.87,32.51 R1.2
N$63
  Bottom 0.178: XTN.LED2 26.92,14.22 25.53,14.22 24.77,13.46 R49.2
N$64
  Bottom 0.178: ALPHA.LED2 7.87,14.22 6.48,14.22 5.71,13.46 R50.2
N$65
  Bottom 0.178: DEL.LED2 45.97,33.27 44.58,33.27 43.82,32.51 R52.2
N$66  (via drill 0.35)
  Top 0.381: v96.52,68.07 94.11,65.66 94.11,61.72 G-.TP | v116.33,73.15 v116.33,89.28
  Bottom 0.381: 6.35,15.87 R50.1 | 6.35,15.87 24.13,15.87 R49.1 24.38,15.87 43.18,15.87 R2.1 43.43,15.87 62.23,15.87 R10.1 62.99,15.37 63.5,15.87 81.79,15.87 R8.1 81.91,19.05 GROUND.TP 83.95,18.92 97.28,18.92 R7.1 100.58,15.87 119.38,15.87 R21.1 119.63,15.87 138.43,15.87 R3.1 138.68,15.87 157.48,15.87 R4.1 157.73,15.87 176.53,15.87 R5.1 176.78,15.87 195.58,15.87 R6.1 | 6.35,34.93 R42.1 5.59,34.16 2.29,34.16 2.29,25.78 6.22,21.84 6.22,16 6.35,15.87 | 6.35,34.93 24.13,34.93 R43.1 24.38,34.93 43.18,34.93 R52.1 43.43,34.93 62.23,34.93 R1.1 62.48,34.93 81.28,34.93 R47.1 81.53,34.93 100.33,34.93 R23.1 100.58,34.93 119.38,34.93 R13.1 119.63,34.93 138.43,34.93 R12.1 138.68,34.93 157.48,34.93 R11.1 157.73,34.93 176.53,34.93 R26.1 176.78,34.93 195.58,34.93 R9.1 | 116.33,92.07 119.38,92.07 R32.1 119.63,92.07 138.43,92.07 R33.1 138.68,92.07 157.48,92.07 R34.1 157.73,92.07 176.53,92.07 R35.1 176.78,92.07 195.58,92.07 | 116.33,92.07 101.6,92.07 R45.1 | 195.58,92.07 R36.1 | R46.1 101.6,111.12 119.38,111.12 R41.1 119.63,111.12 138.43,111.12 R40.1 138.68,111.12 157.48,111.12 R39.1 157.73,111.12 176.53,111.12 R38.1 176.78,111.12 192.79,111.12 | 192.79,111.12 195.58,111.12 R37.1 | 195.58,92.07 199.26,95.76 199.26,101.6 195.2,101.6 192.79,104.01 192.79,111.12 | 116.33,73.02 119.38,73.02 R29.1 119.63,73.02 138.43,73.02 R28.1 138.68,73.02 157.48,73.02 R27.1 157.73,73.02 176.53,73.02 R25.1 176.78,73.02 195.58,73.02 R22.1 | 116.33,73.02 101.6,73.02 R44.1 100.84,72.26 100.2,71.63 100.08,71.63 v96.52,68.07 | 91.69,54.48 92.33,55.12 92.33,59.94 G-.TP | 91.69,54.48 91.57,54.36 82.93,54.36 R53.1 81.79,53.47 80.14,55.12 64.64,55.12 62.99,53.47 R14.1 62.23,53.98 43.43,53.98 R15.1 43.18,53.98 24.38,53.98 R30.1 24.13,53.98 6.35,53.98 R31.1 5.59,53.21 2.29,53.21 2.29,44.83 6.22,40.89 6.22,35.05 6.35,34.93
  Bottom 0.381: 91.69,54.48 91.82,54.36 99.95,54.36 R48.1 100.58,53.98 119.38,53.98 R16.1 119.63,53.98 138.43,53.98 R17.1 138.68,53.98 157.48,53.98 R18.1 157.73,53.98 176.53,53.98 R19.1 176.78,53.98 195.58,53.98 R20.1 | v116.33,89.28 116.33,92.07 | v116.33,73.15 116.33,73.02
N$67
  Bottom 0.178: AUX.LED2 65.02,14.22 63.63,14.22 62.87,13.46 R10.2
N$68
  Top 0.178: AUX.SW1 68.58,6.99 67.94,6.35 59.56,6.35 59.56,15.75 SW1.TP
N$69
  Top 0.178: AUX.SW2 73.79,4.45 73.79,11.94 SW2.TP
N$70
  Top 0.61: VBATT.TP VIN.TP
N$71  (via drill 0.35)
  Top 0.178: v95.5,13.46 95.12,13.84 95.12,53.47 91.31,57.28 v91.31,58.42
  Bottom 0.178: ON.SW1 52.32,6.1 69.09,6.1 69.85,5.33 73.66,5.33 80.64,12.32 84.33,12.32 85.47,13.46 v95.5,13.46 | v91.31,58.42 91.31,58.8 90.8,59.31 90.8,63.75 92.33,63.75 ON1.TP
N$72  (via drill 0.35)
  Top 0.178: ON.SW2 62.48,4.45 62.48,3.81 63.5,2.79 103.89,2.79 103.89,5.08 101.47,7.49 96.9,7.49 96.9,54.23 98.3,55.63 v98.3,61.72
  Bottom 0.178: ON2.TP v98.3,61.72
N$76
  Top 0.381: ALPHA.LED1 16.76,20.57 16.76,29.34 12.45,33.66 2ND.LED1 | 86.99,33.34 VARS.LED1 | 192.79,109.85 197.48,109.85 197.48,110.36 198.25,111.12 201.29,111.12 ^^.LED1 | 192.79,109.85 TAN.LED1 | 143,111 142.88,111.12 125.09,111.12 X^-1.LED1 | 143,111 SIN.LED1 | COS.LED1 161.92,111.12 143.13,111.12 143,111 | DIVIDE.LED1 192.79,99.31 192.79,109.85 | 47.75,53.85 47.62,53.98 40.39,53.98 | 47.75,53.85 ZOOM.LED1 | 40.39,53.98 29.84,53.98 WINDOW.LED1 | TRACE.LED1 66.67,53.98 47.88,53.98 47.75,53.85 | DEL.LED1 40.39,42.16 40.39,53.98
  Top 0.61: LEFT.LED1 86.36,14.6 84.77,16.19 82.87,16.19 VOUT.TP 80.01,26.13 78.47,27.67 78.47,29.48 80.89,31.9 85.55,31.9 86.99,33.34
  Bottom 0.381: LEFT.LED1 87.25,14.35 97.92,14.35 100.08,12.19 102.87,12.19 105.16,14.48 105.92,14.48 DOWN.LED1 108.46,12.19 121.92,12.19 124.33,14.6 RIGHT.LED1 127.51,12.19 140.97,12.19 143.26,14.48 144.02,14.48 0.LED1 146.56,12.19 160.02,12.19 162.43,14.6 (.).LED1 165.61,12.19 179.07,12.19 181.36,14.48 182.12,14.48 (-).LED1 184.66,12.19 198.12,12.19 200.53,14.6 ENTER.LED1 | PLUS.LED1 199.39,31.75 197.61,31.75 197.1,31.24 184.66,31.24 3.LED1 181.48,33.66 179.07,31.24 165.61,31.24 2.LED1 163.07,33.53 162.31,33.53 160.02,31.24 146.56,31.24 1.LED1 143.38,33.66 140.97,31.24 127.51,31.24 STO.LED1 123.19,31.75 121.41,31.75 120.9,31.24 115.44,31.24 113.16,33.53 106.17,33.53 UP.LED1 105.28,33.66 102.87,31.24 89.41,31.24 VARS.LED1 85.09,31.75 83.31,31.75 82.8,31.24 70.36,31.24 STAT.LED1 67.18,33.66 64.77,31.24 51.31,31.24 DEL.LED1 48.77,33.53 48.01,33.53 45.72,31.24 32.26,31.24 MODE.LED1 29.08,33.66 26.67,31.24 13.21,31.24 2ND.LED1 | ALPHA.LED1 13.21,12.19 26.67,12.19 29.08,14.6 XTN.LED1 32.26,12.19 45.72,12.19 48.01,14.48 48.77,14.48 ON.LED1 51.31,12.19 64.77,12.19 67.18,14.6 AUX.LED1 | 192.79,69.34 198.12,69.34 200.53,71.75 | 192.79,69.34 184.66,69.34 9.LED1 180.34,69.85 178.56,69.85 178.05,69.34 165.61,69.34 8.LED1 162.43,71.75 160.02,69.34 146.56,69.34 7.LED1 144.02,71.63 143.26,71.63 140.97,69.34 127.51,69.34 LOG.LED1 124.33,71.75 121.92,69.34 108.46,69.34 MATH.LED1 | TIMES.LED1 200.53,71.75 | APPS.LED1 108.46,88.39 121.92,88.39 124.33,90.8 X^2.LED1 127.51,88.39 140.97,88.39 143.26,90.68 144.02,90.68 ,,,.LED1 146.56,88.39 160.02,88.39 162.43,90.8 ((.LED1 165.61,88.39 179.07,88.39 181.36,90.68 182.12,90.68 )).LED1 184.66,88.39 192.79,88.39
  Bottom 0.381: 192.79,88.39 198.12,88.39 200.53,90.8 DIVIDE.LED1 | PGRM.LED1 108.46,107.44 121.92,107.44 124.33,109.85 X^-1.LED1 | TAN.LED1 180.34,107.95 178.56,107.95 178.05,107.44 165.61,107.44 COS.LED1 | 192.79,88.39 192.79,84.96 195.33,82.42 200.41,82.42 200.41,71.88 200.53,71.75 | Y=.LED1 13.21,50.29 26.67,50.29 29.08,52.7 WINDOW.LED1 | TRACE.LED1 70.36,50.29 82.8,50.29 83.31,50.8 85.09,50.8 GRAPH.LED1 87.12,52.58 89.41,52.58 91.69,50.29 101.85,50.29 102.36,50.8 104.14,50.8 CLEAR.LED1 106.17,52.58 111,52.58 113.28,50.29 120.9,50.29 121.41,50.8 123.19,50.8 LN.LED1 127.51,50.29 140.97,50.29 143.38,52.7 4.LED1 146.56,50.29 160.02,50.29 162.31,52.58 163.07,52.58 5.LED1 165.61,50.29 179.07,50.29 181.48,52.7 6.LED1 184.66,50.29 197.1,50.29 197.61,50.8 199.39,50.8 MINUS.LED1 201.17,52.83 201.17,60.32 198.12,63.37 192.79,63.37 192.79,69.34

### Text on the board
bNames: 1 2 3 4 5 6 7 | + | + | + | + | + | + | A B C D E F G H | + | + | + | + | + | + | + | + | + | + | + | + | + | + | + | + | + | + | + | + | + | + | + | + | + | + | + | + | + | + | + | + | + | + | Version 1.0, Dec 5 2020 | Noah Kiser "NoahK" noahkiser.com TI-84 Keyboard Edition (TI-84 KE) cemetech.net | + | + | + | + | + | + | + | + | + | + | +